# EasyEDA Pro project 信号继电器.epro

# Schematic Schematic1
Assembly Variant: Basic; Board Name: Board1; Create Date: 2026-07-05; Page Name: P1; Project Name: 继电器; Schematic Name: Schematic1; Update Date: 2026-07-05; BladeWidth: 10; Company: 嘉立创EDA; Page Size: A4; RegionStart: 1; ShowBorder: 1; TitleBlock: 1; TitleBlockPosition: 3; Version: V1.0; XRegionCount: 6; YRegionCount: 4
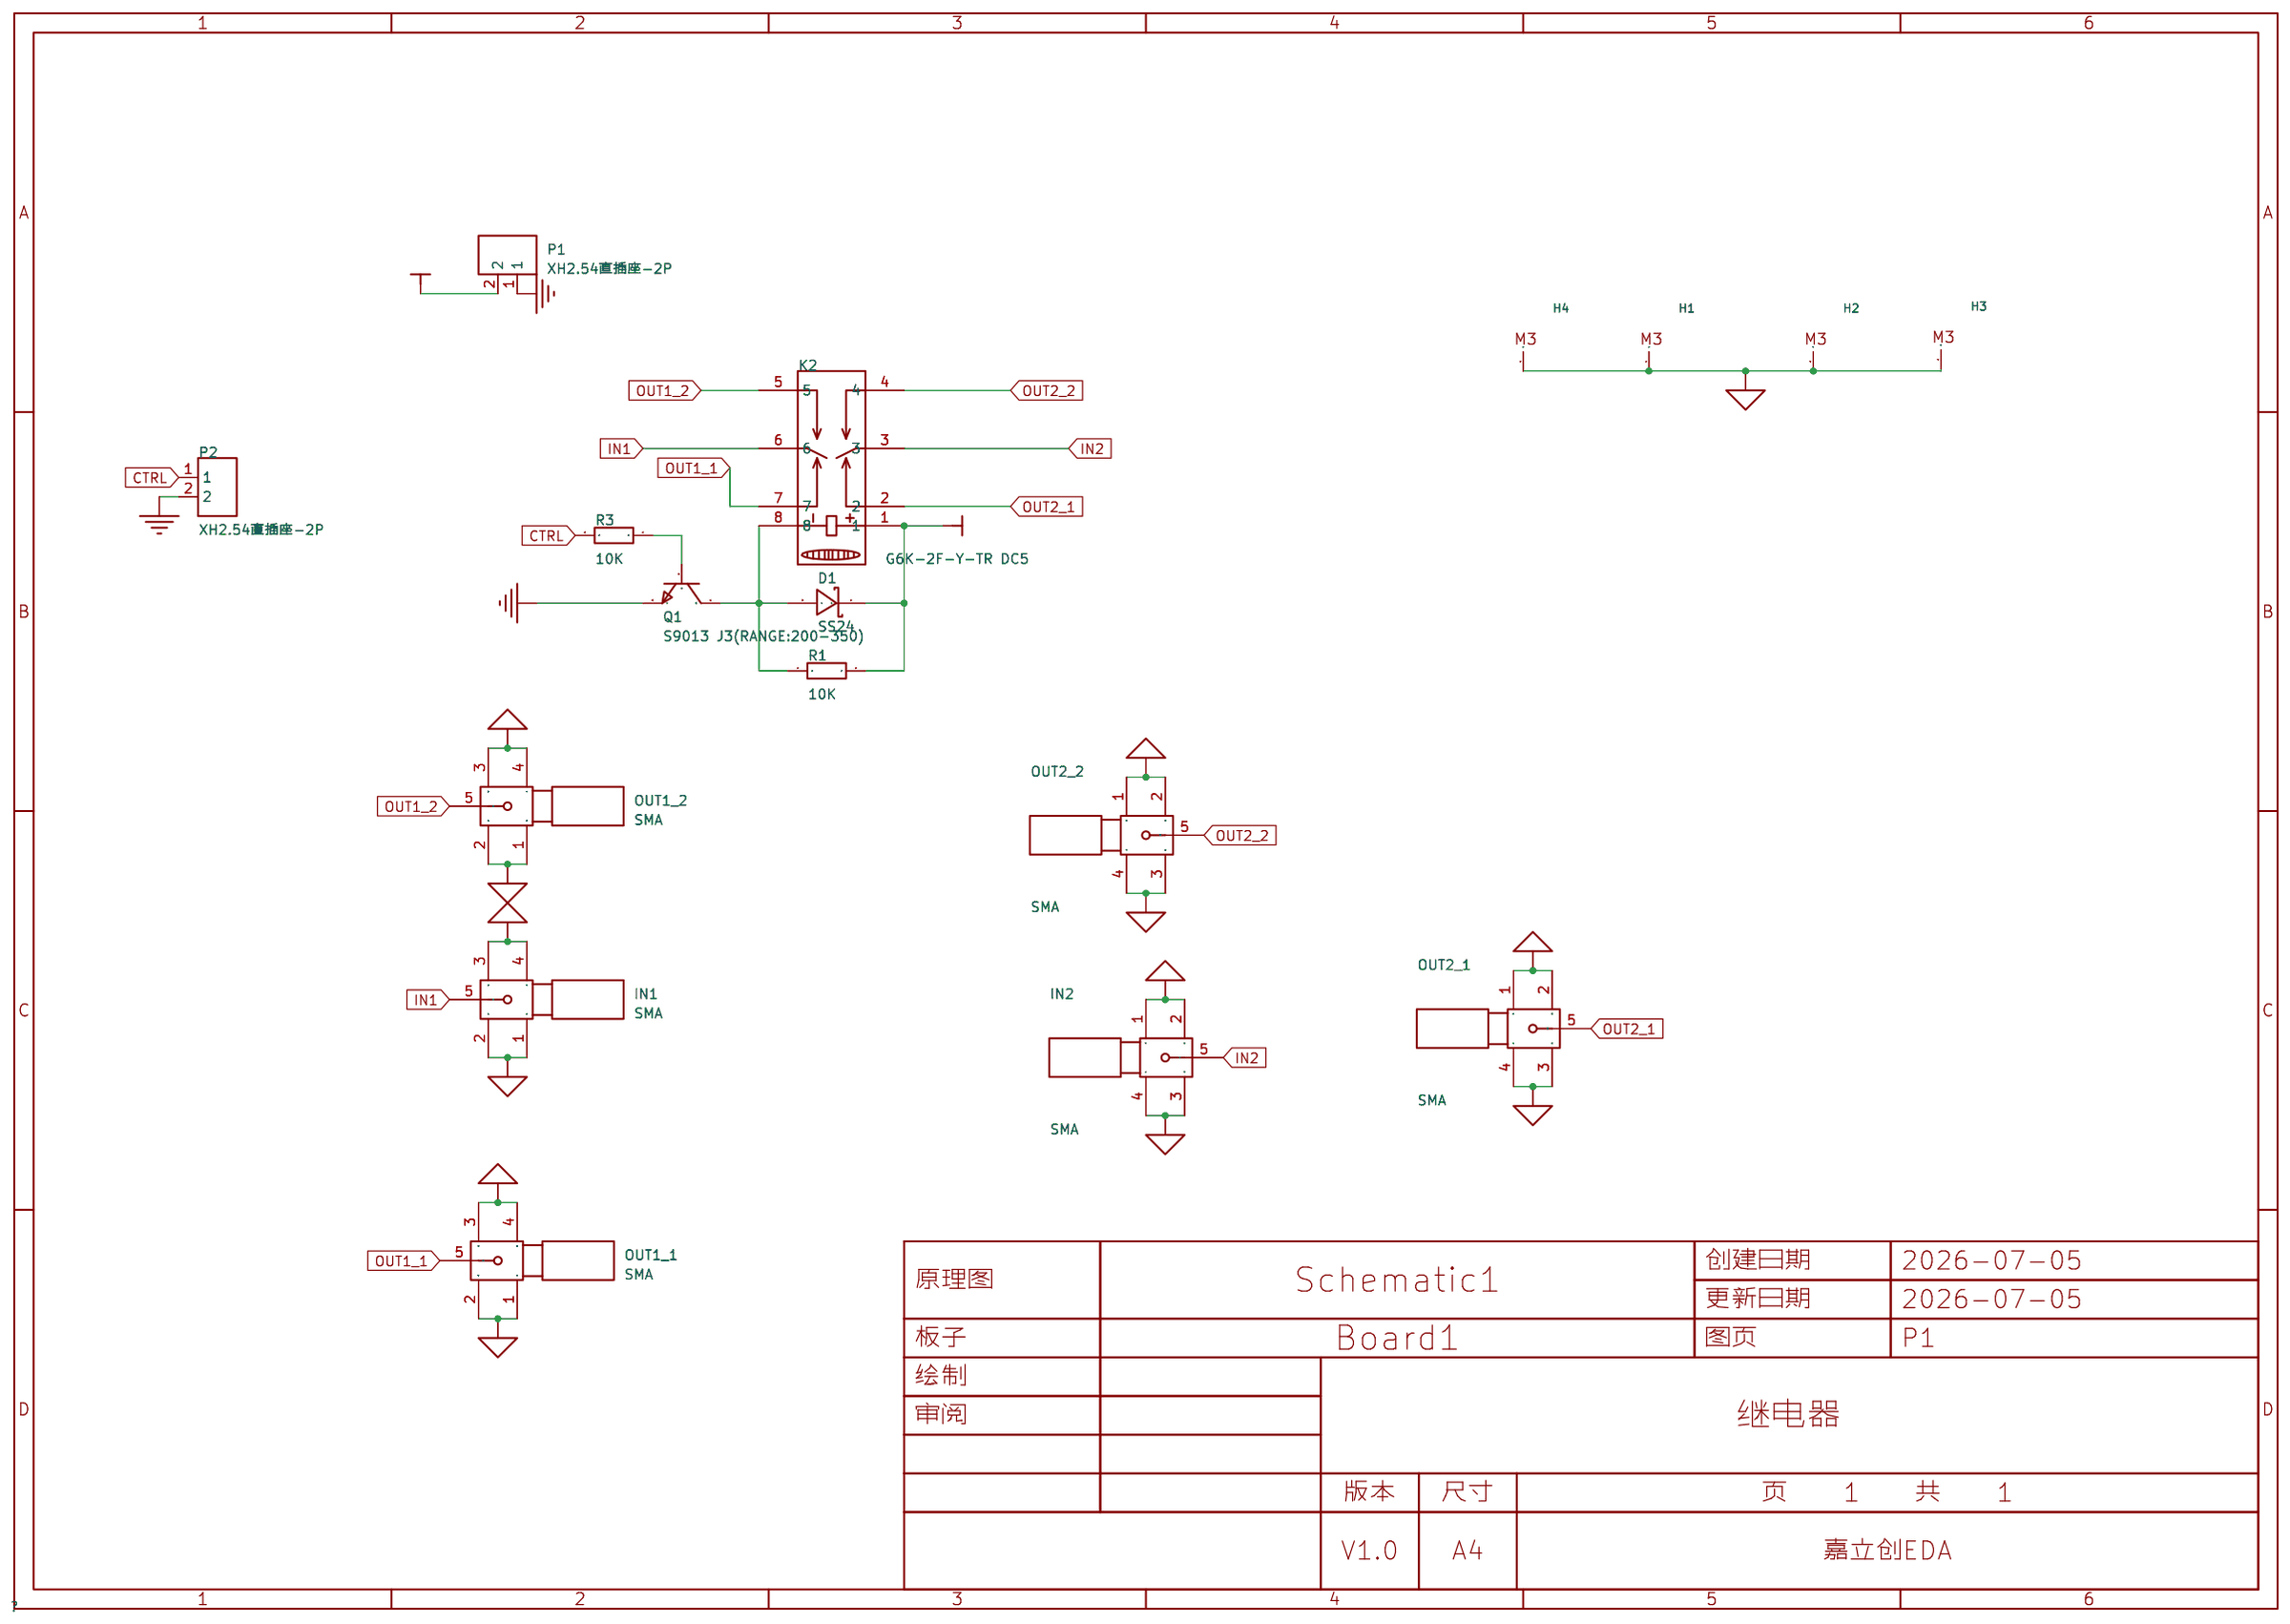
[diagram p0: schematic sheet]

## Parts
D1  SS24  [SMA_L4.3-W2.6-LS5.2-RD]
H1  -  [M3]
H2  -  [M3]
H3  -  [M3]
H4  -  [M3]
IN1  SMA  [SMA-SMD_BWSMA-KE-P001]
IN2  SMA  [SMA-SMD_BWSMA-KE-P001]
K2  G6K-2F-Y-TR DC5  [RELAY-SMD_G6K-2F-X-XX]
OUT1_1  SMA  [SMA-SMD_BWSMA-KE-P001]
OUT1_2  SMA  [SMA-SMD_BWSMA-KE-P001]
OUT2_1  SMA  [SMA-SMD_BWSMA-KE-P001]
OUT2_2  SMA  [SMA-SMD_BWSMA-KE-P001]
P1  XH2.54直插座-2P  [CONN-TH_XH2.54-2P]
P2  XH2.54直插座-2P  [CONN-TH_XH2.54-2P]
Q1  S9013 J3(RANGE:200-350)  [SOT-23-3_L2.9-W1.3-P1.90-LS2.4-BR]
R1  10K  [R0805]
R3  10K  [R0805]

## Library data of the parts
D1 = SS24: 正向压降(Vf):550mV@2A;直流反向耐压(Vr):40V;平均整流电流(Io):2A;; LCSC Part Name: 电压:40V 电流:2A; Supplier Part: C13444; Supplier Footprint: SMA(DO-214AC); JLCPCB Part Class: Extended Part; Supplier: LCSC; Forward Voltage (Vf@If): 550mV@2A; Reverse Voltage (Vr): 40V; Average Rectified Current (Io): 2A
H1-H4 = 螺丝孔
IN1 IN2 OUT1_1 OUT1_2 OUT2_1 OUT2_2 = SMA: Supplier Part: C9900018296; JLCPCB Part Class: Extended Part; Supplier: LCSC
K2 = G6K-2F-Y-TR DC5: 线圈电压:5V;触点形式:两组转换:2C(双刀双掷-转换);触点容量(电阻负载):-;最大切换电压:125V@AC；60V@DC;最大切换电流:1A;; Supplier Part: C47190; Manufacturer: OMRON(欧姆龙); Supplier Footprint: SMD,10x6.5mm; JLCPCB Part Class: Extended Part; Datasheet: https://item.szlcsc.com/datasheet/G6K-2F-Y-TR%2520DC5/48195.html; Supplier: LCSC; Coil Voltage: 5V; Contact Form: 两组转换:2C(双刀双掷-转换); Switching Voltage(Max): 125V@AC；60V@DC; Contact Material: 银+镀金; Switching Current(Max): 1A; Operate Time: 3ms; Release Time: 3ms; Operating Temperature: -40℃~+70℃
P1 P2 = XH2.54直插座-2P: Supplier Part: C9900016957; Supplier Footprint: XH2.54-2; JLCPCB Part Class: Extended Part; Supplier: LCSC
Q1 = S9013 J3(RANGE:200-350): 晶体管类型:NPN;集电极电流(Ic):500mA;集射极击穿电压(Vceo):25V;功率(Pd):300mW;直流电流增益(hFE@Ic,Vce):120@50mA,1V;; LCSC Part Name: NPN 电流:500mA 耐压:25V H档(200-350); Supplier Part: C6749; Manufacturer: CJ(江苏长电/长晶); Supplier Footprint: SOT-23; JLCPCB Part Class: Basic Part; Datasheet: https://atta.szlcsc.com/upload/public/pdf/source/20140809/1457707213610.pdf; Supplier: LCSC; Transistor Type: NPN; Collector Current (Ic): 500mA; Collector-Emitter Breakdown Voltage (Vceo): 25V; Power Dissipation (Pd): 300mW; DC Current Gain (hFE@Ic,Vce): 120@50mA,1V; Transition Frequency (fT): 150MHz; Collector Cut-Off Current (Icbo): 100nA; Collector-Emitter Saturation Voltage (VCE(sat)@Ic,Ib): 600mV@500mA,50mA; Operating Temperature: -55℃~+150℃
R1 R3 = Res_0805: Supplier Footprint: 0805

## Nets
AGND: H1.1 H2.1 H3.1 H4.1 IN1.1 IN1.2 IN1.3 IN1.4 IN2.1 IN2.2 IN2.3 IN2.4 OUT1_1.1 OUT1_1.2 OUT1_1.3 OUT1_1.4 OUT1_2.1 OUT1_2.2 OUT1_2.3 OUT1_2.4 OUT2_1.1 OUT2_1.2 OUT2_1.3 OUT2_1.4 OUT2_2.1 OUT2_2.2 OUT2_2.3 OUT2_2.4
GND: P1.1 P2.2 Q1.2(E)
VCC: D1.1(K) K2.1 P1.2 R1.2
CTRL: P2.1 R3.2
IN1: IN1.5 K2.6
IN2: IN2.5 K2.3
OUT1_1: K2.7 OUT1_1.5
OUT1_2: K2.5 OUT1_2.5
OUT2_1: K2.2 OUT2_1.5
OUT2_2: K2.4 OUT2_2.5
$1N10: D1.2(A) K2.8 Q1.3(C) R1.1
$1N15: Q1.1(B) R3.1

# Board PCB1
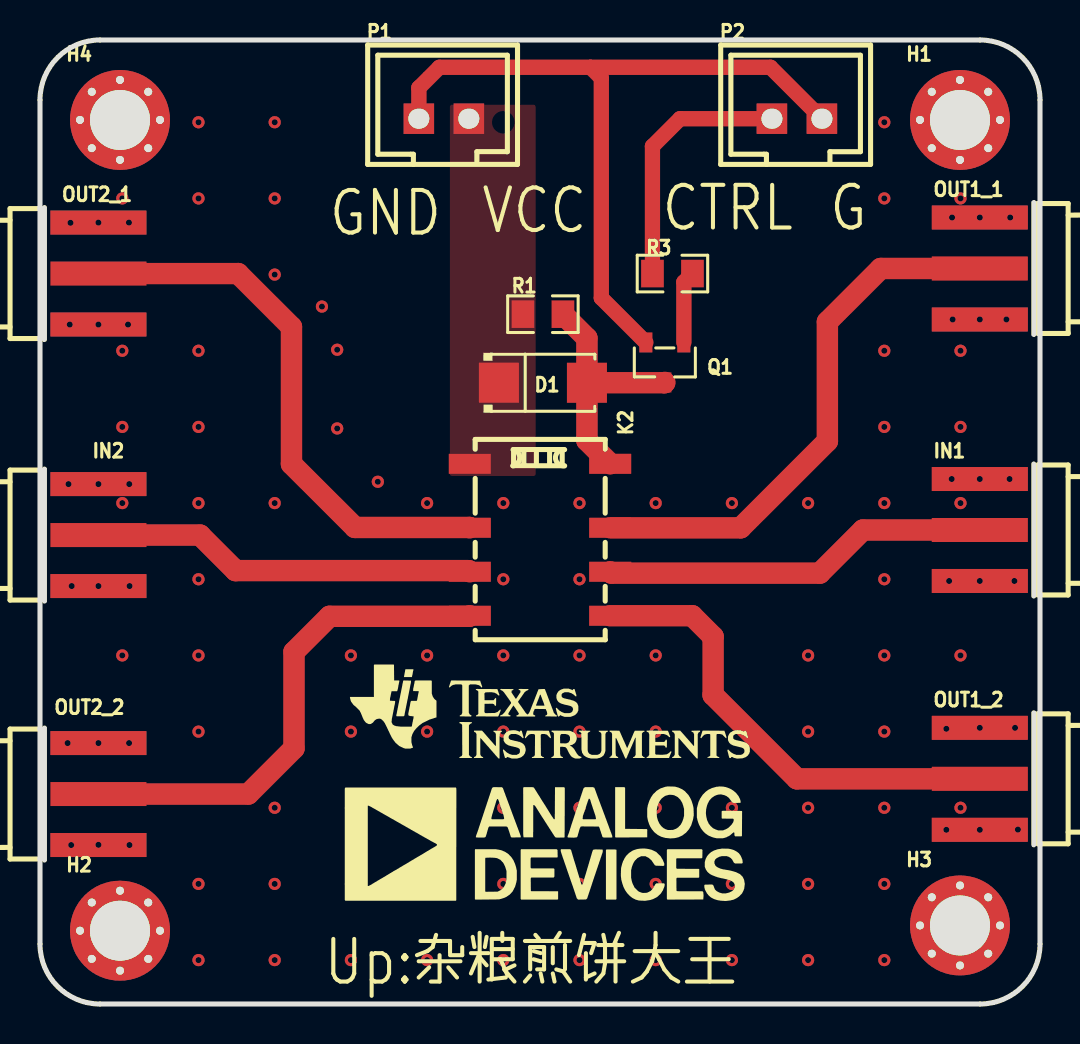
[diagram p1: board, top side]
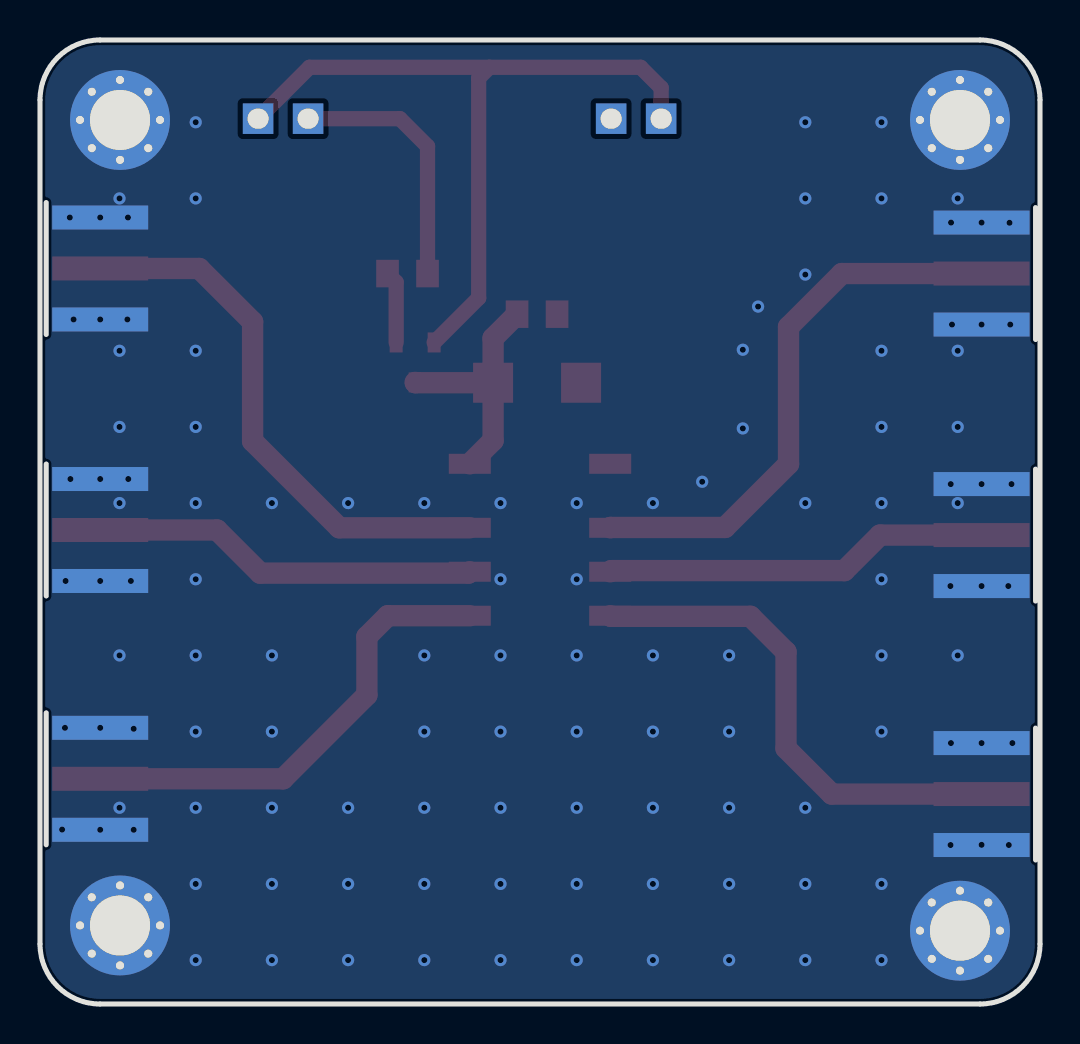
[diagram p2: board, bottom side, seen from below]

Outline 50 x 48.22 mm; copper layers: Top Layer, Bottom Layer. Coordinates in mm from the lower left corner of the outline.
Outline path: 0,45.22 0,3 arc(0.88,0.88) 3,0 47,0 arc(49.12,0.88) 50,3 50,45.22 arc(49.12,47.34) 47,48.22 3,48.22 arc(0.88,47.34) 0,45.22
Stack: Top Layer 0.035mm / Dielectric1 1.51mm FR4 er 4.5 / Bottom Layer 0.035mm

## Design rules (mm)
spacing copperThickness1oz (default): track to track 0.102, other pairs 0.152 to 0.3
spacing copperThickness2oz: track to track 0.203, other pairs 0.152 to 0.3
track width copperThickness1oz (default): min 0.127, default 0.254, max 2.54
track width copperThickness2oz: min 0.203, default 0.254, max 2.54
differential pair differentialPair (default): width min 0.127, default 0.254, max 2.54; gap min 0.152, default 0.152
net VCC uses copperRegion
net GND uses copperRegion

## Placement (name value [footprint] x y rotation side)
D1  SS24  [SMA_L4.3-W2.6-LS5.2-RD]  25.15 31.08 0 top
H1  -  [M3]  46 44.22 0 top
H2  -  [M3]  4 3.67 0 top
H3  -  [M3]  46 3.93 0 top
H4  -  [M3]  4 44.22 0 top
IN1  SMA  [SMA-SMD_BWSMA-KE-P001]  46.99 23.71 0 top
IN2  SMA  [SMA-SMD_BWSMA-KE-P001]  2.92 23.46 180 top
K2  G6K-2F-Y-TR DC5  [RELAY-SMD_G6K-2F-X-XX]  25 23.22 270 top
OUT1_1  SMA  [SMA-SMD_BWSMA-KE-P001]  46.99 36.79 0 top
OUT1_2  SMA  [SMA-SMD_BWSMA-KE-P001]  46.99 11.27 0 top
OUT2_1  SMA  [SMA-SMD_BWSMA-KE-P001]  2.92 36.54 180 top
OUT2_2  SMA  [SMA-SMD_BWSMA-KE-P001]  2.92 10.5 180 top
P1  XH2.54直插座-2P  [CONN-TH_XH2.54-2P]  20.19 44.29 0 top
P2  XH2.54直插座-2P  [CONN-TH_XH2.54-2P]  37.85 44.29 0 top
Q1  S9013 J3(RANGE:200-350)  [SOT-23-3_L2.9-W1.3-P1.90-LS2.4-BR]  31.24 32.09 90 top
R1  10K  [R0805]  25.15 34.51 180 top
R3  10K  [R0805]  31.62 36.54 180 top

## Footprints (pads in the part's own frame, mm; a bottom-side part is the same pattern mirrored in y, then rotated)
CONN-TH_XH2.54-2P
  rect 1.524x1.524 hole 1.05x1: 1(-1.25,0) 2(1.25,0)
M3
  round 0.6 hole 0.405x0.4: 1(-2,0) 1(-1.41,1.41) 1(-1.41,-1.41) 1(0,2) 1(0,-2) 1(1.41,1.41) 1(1.41,-1.41) 1(2,0)
  round 5 hole 3.005x3: 1(0,0)
R0805
  rect 1.133x1.377 smd: 1(-1,0) 2(1,0)
RELAY-SMD_G6K-2F-X-XX
  rect 1x2.1 smd: 1(-3.8,-3.51) 2(-0.6,-3.51) 3(1.6,-3.51) 4(3.8,-3.51) 5(3.8,3.51) 6(1.6,3.51) 7(-0.6,3.51) 8(-3.8,3.51)
SMA-SMD_BWSMA-KE-P001
  rect 4.8x1.2 smd: 1(0,-2.55) 2(0,2.55) 5(0,0)
  rect 4.8x1.2 smd far side: 3(0,2.55) 4(0,-2.55)
SMA_L4.3-W2.6-LS5.2-RD
  rect 2x2 smd: 1(-2.2,0) 2(2.2,0)
SOT-23-3_L2.9-W1.3-P1.90-LS2.4-BR
  rect 1x0.65 smd: 1(1,-0.95) 2(1,0.95) 3(-1,0)

## Nets
As in the schematic.

## Via types
v1: diameter 0.61, hole 0.305, Top Layer to Bottom Layer, 120 vias

## Routing (per net, layer and track width the routed paths; a pad name or vN(x,y) marks a point on that pad's centre or on a via; arc(x,y) is an arc through that point)
AGND:
  vias: v1(1.42,26.01) v1(1.38,13.05) v1(1.52,39.08) v1(1.49,33.99) v1(1.59,20.91) v1(1.56,7.95) v1(2.92,39.09) v1(2.92,33.99) v1(2.92,26.01) v1(2.92,20.91) v1(2.92,13.05) v1(2.92,7.96) v1(4.11,40.3) v1(4.11,32.68) v1(4.11,28.87) v1(4.11,25.06) v1(4.11,17.44) v1(4.45,39.09) v1(4.4,33.99) v1(4.46,26.01) v1(4.48,20.91) v1(4.45,13.05) v1(4.47,7.95) v1(7.92,44.11) v1(7.92,40.3) v1(7.92,32.68) v1(7.92,28.87) v1(7.92,25.06) v1(7.92,21.25) v1(7.92,17.44) v1(7.92,13.63) v1(7.92,6.01) v1(7.92,2.2) v1(11.74,44.11) v1(11.74,40.3) v1(11.74,36.49) v1(11.74,25.06) v1(11.74,9.82) v1(11.74,6.01) v1(11.74,2.2) v1(14.1,34.89) v1(14.86,32.73) v1(14.86,28.79) v1(15.54,17.44) v1(15.54,13.63) v1(15.54,9.82) v1(15.54,6.01) v1(15.54,2.2) v1(16.89,26.12) v1(19.35,25.06) v1(19.35,17.44) v1(19.35,13.63) v1(19.35,9.82) v1(19.35,6.01) v1(19.35,2.2) v1(23.16,25.06) v1(23.16,21.25) v1(23.16,17.44) v1(23.16,13.63) v1(23.16,9.82) v1(23.16,6.01) v1(23.16,2.2) v1(26.97,25.06) v1(26.97,21.25) v1(26.97,17.44) v1(26.97,13.63) v1(26.97,9.82) v1(26.97,6.01) v1(26.97,2.2) v1(30.78,25.06) v1(30.78,17.44) v1(30.78,13.63) v1(30.78,9.82) v1(30.78,6.01) v1(30.78,2.2) v1(34.59,25.06) v1(34.59,9.82) v1(34.59,6.01) v1(34.59,2.2) v1(38.41,25.06) v1(38.41,17.44) v1(38.41,13.63) v1(38.41,9.82) v1(38.41,6.01) v1(38.41,2.2) v1(42.22,44.11) v1(42.22,40.3) v1(42.22,32.68) v1(42.22,28.87) v1(42.22,25.06) v1(42.22,21.25) v1(42.22,17.44) v1(42.22,13.63) v1(42.22,9.82) v1(42.22,6.01) v1(42.22,2.2) v1(45.32,13.77) v1(45.32,8.72) v1(45.46,21.16) v1(45.6,39.34) v1(45.63,34.24) v1(45.59,26.26) v1(46.03,40.3) v1(46.03,32.68) v1(46.03,28.87) v1(46.03,25.06) v1(46.03,17.44) v1(46.03,9.82) v1(46.99,39.34) v1(46.99,34.24) v1(46.99,26.26) v1(46.99,21.16) v1(46.99,13.82) v1(46.99,8.72) v1(48.32,34.24) v1(48.51,39.34) v1(48.48,26.26) v1(48.72,21.16) v1(48.75,13.82) v1(48.9,8.73)
GND: length 38.1
  Top Layer w0.762: 27.53,46.86 36.53,46.86 P2.2 ; 27.53,46.86 28.07,46.32 28.07,35.32 Q1.2 ; 27.53,46.86 19.97,46.86 18.94,45.83 P1.1
CTRL: length 12.9
  Top Layer w0.762: R3.2 30.62,42.9 32,44.29 P2.1
IN1: length 19.4
  Top Layer w1.067: K2.6 28.58,21.55 38.99,21.55 41.15,23.71 IN1.5
IN2: length 19.3
  Top Layer w1.067: K2.3 21.43,21.68 9.78,21.68 8,23.46 IN2.5
OUT1_1: length 27.3
  Top Layer w1.067: OUT1_1.5 42.04,36.79 39.37,34.13 39.37,28.16 35.04,23.82 K2.7
OUT1_2: length 23.6
  Top Layer w1.067: K2.5 32.61,19.42 33.66,18.38 33.66,15.46 37.85,11.27 OUT1_2.5
OUT2_1: length 27.9
  Top Layer w1.067: K2.2 21.47,23.84 15.75,23.84 12.57,27.01 12.57,33.87 9.91,36.54 OUT2_1.5
OUT2_2: length 25.1
  Top Layer w1.067: K2.4 21.46,19.39 14.48,19.39 12.7,17.62 12.7,12.79 10.41,10.5 OUT2_2.5
$1N10: length 12.4
  Top Layer w1.067: D1.2 27.35,28.19 K2.8 ; D1.2 31.23,31.08 Q1.3 ; D1.2 27.35,33.31 R1.1
$1N15: length 3.6
  Top Layer w0.762: Q1.1 32.19,36.11 R3.1

## Copper pours and planes (outline as drawn; the poured copper is in the pictures)
AGND on Bottom Layer: -0.13,48.35 50.16,48.35 50.16,0.09 -0.13,0.09
VCC on Top Layer: 20.49,44.98 24.78,44.98 24.78,26.41 20.49,26.41

## Text on the board
Top Silkscreen Layer: GND | VCC | CTRL | G | Up:杂粮煎饼大王
